# EAGLE design blink1mk3_usbc3535A (EAGLE 9.6.2)
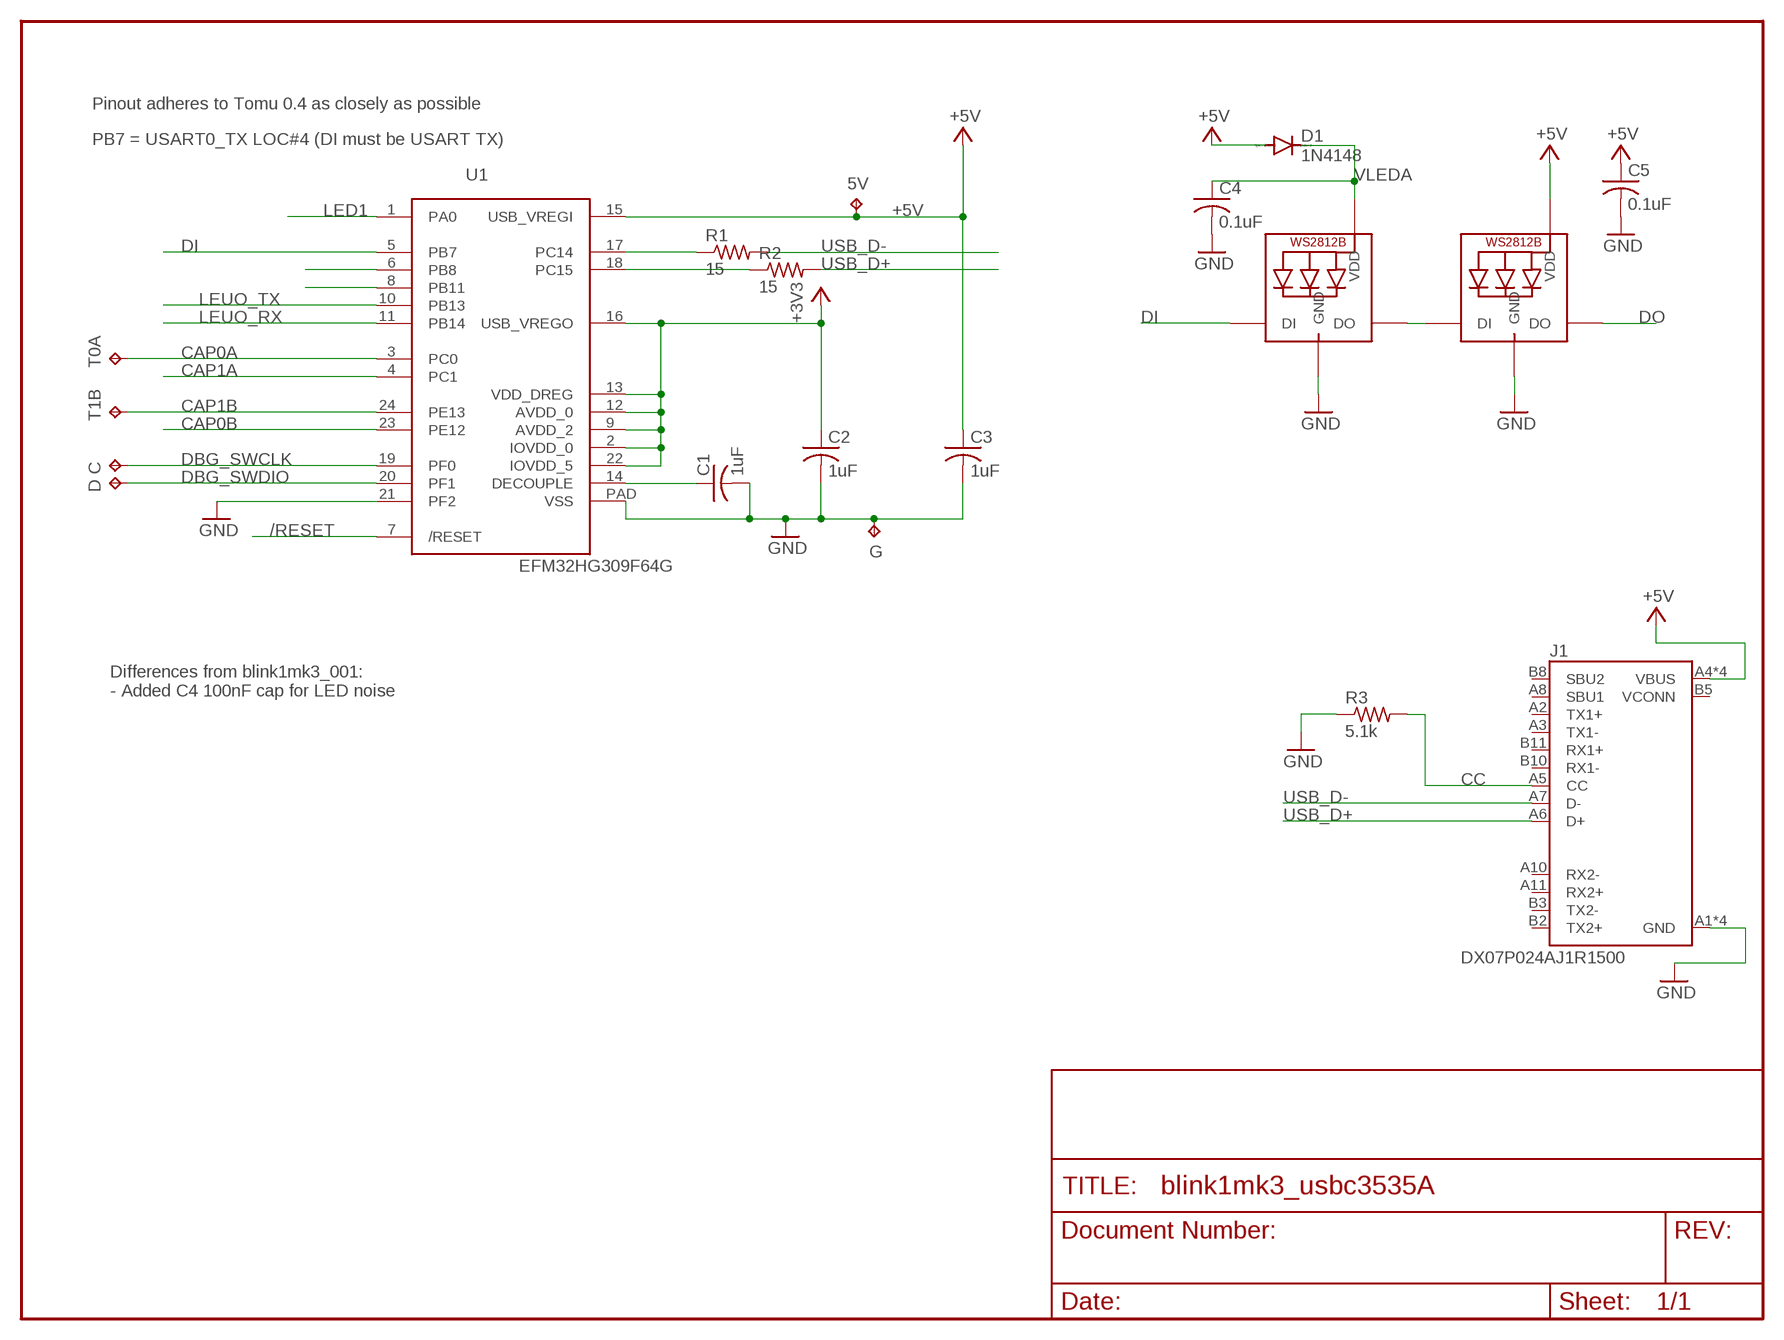
[diagram p0: schematic, sheet 1]

## Parts
5V  TPTP10R  [TP10R]
C  TPTP10R  [TP10R]
C1  1uF  C-USC0402  [C0402]
C2  1uF  C-USC0402  [C0402]
C3  1uF  C-USC0402  [C0402]
C4  0.1uF  C-USC0402  [C0402]
C5  0.1uF  C-USC0402  [C0402]
D  TPTP10R  [TP10R]
D1  1N4148  DIODE-SOD523  [SOD523]
G  TPTP10R  [TP10R]
J1  DX07P024AJ1R1500  [JAE_DX07P024AJ1R1500]
LED1  WS2812B3535  [LED3535]
LED2  SK6812MINI  WS2812B3535  [LED3535]
R1  15  R-US_R0402  [R0402]
R2  15  R-US_R0402  [R0402]
R3  5.1k  R-US_R0402  [R0402]
T0A  TPTP10R  [TP10R]
T1B  TPTP10R  [TP10R]
U1  EFM32HG309F64G  [QFN24PAD]

## Nets
+3V3: C2.1 U1.2(IOVDD_0) U1.9(AVDD_2) U1.12(AVDD_0) U1.13(VDD_DREG) U1.16(USB_VREGO) U1.22(IOVDD_5)
+5V: 5V.TP C3.1 C5.1 D1.A J1.A4(VBUS) J1.A9(VBUS) J1.B4(VBUS) J1.B9(VBUS) LED2.2(VDD) U1.15(USB_VREGI)
/RESET: U1.7(/RESET)
CAP0A: T0A.TP U1.3(PC0)
CAP0B: U1.23(PE12)
CAP1A: U1.4(PC1)
CAP1B: T1B.TP U1.24(PE13)
CC: J1.A5(CC) R3.2
DBG_SWCLK: C.TP U1.19(PF0)
DBG_SWDIO: D.TP U1.20(PF1)
DECOUPLE: C1.1 U1.14(DECOUPLE)
DI: LED1.1(DI) U1.5(PB7)
DO: LED2.3(DO)
GND: C1.2 C2.2 C3.2 C4.2 C5.2 G.TP J1.A1(GND) J1.A12(GND) J1.B1(GND) J1.B12(GND) LED1.4(GND) LED2.4(GND) R3.1 U1.21(PF2) U1.PAD(VSS)
LED1: U1.1(PA0)
LEUO_RX: U1.11(PB14)
LEUO_TX: U1.10(PB13)
N$1: U1.8(PB11)
N$2: LED1.3(DO) LED2.1(DI)
N$3: U1.6(PB8)
RUSB_D+: R2.1 U1.18(PC15)
RUSB_D-: R1.1 U1.17(PC14)
USB_D+: J1.A6(D+) R2.2
USB_D-: J1.A7(D-) R1.2
VLEDA: C4.1 D1.C LED1.2(VDD)
Unconnected: J1.A2(TX1+) J1.A3(TX1-) J1.A8(SBU1) J1.A10(RX2-) J1.A11(RX2+) J1.B2(TX2+) J1.B3(TX2-) J1.B8(SBU2) J1.B10(RX1-) J1.B11(RX1+)

## Notes on the sheet
- Pinout adheres to Tomu 0.4 as closely as possible
- PB7 = USART0_TX LOC#4 (DI must be USART TX)
- Differences from blink1mk3_001:
  - Added C4 100nF cap for LED noise

## Power pins joined to a net without a drawn wire
VCONN: J1.B5(VCONN)

## Library data of the parts
5V C D G T0A T1B = testpad:TP: Test pad
C1-C5 = rcl:C-US: CAPACITOR, American symbol; SPICEPREFIX: C
D1 = diode:DIODE-: DIODE
J1 = DX07P024AJ1R1500:DX07P024AJ1R1500: Cut Tape - Usb Type c Slim Plug; DESCRIPTION: Cut Tape - Usb Type c Slim Plug; DIGI-KEY_PART_NUMBER: 670-2868-1-ND; DIGI-KEY_PURCHASE_URL: https://www.digikey.com/product-detail/en/jae-electronics/DX07P024AJ1R1500/670-2868-1-ND/6003057?utm_source=snapeda&utm_medium=aggregator&utm_campaign=symbol; MF: JAE Electronics; MP: DX07P024AJ1R1500; PACKAGE: None
LED1 = todstuff:WS2812B
LED2 = adafruit:WS2812B
R1-R3 = rcl:R-US_: RESISTOR, American symbol; SPICEPREFIX: R
U1 = todstuff:EFM32HG309F64G

## Board
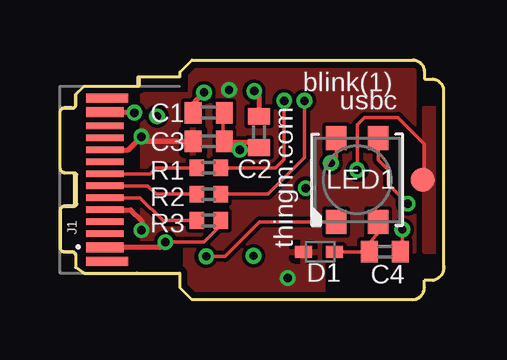
[diagram p1: board, top side]
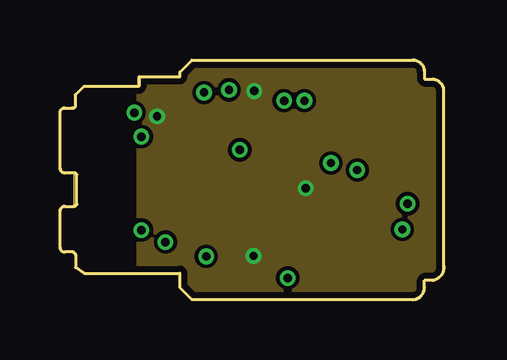
[diagram p2: board, inner layer Route2]
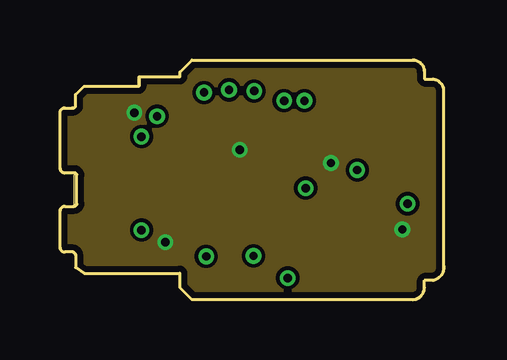
[diagram p3: board, inner layer Route15]
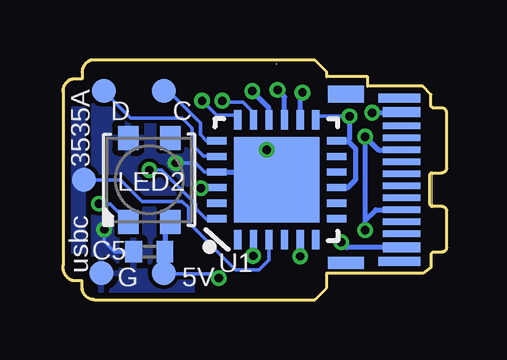
[diagram p4: board, bottom side, seen from below]

Size 16.01 x 10 mm. Coordinates in mm from the lower left corner, seen from the top.
Outline: 3.3,9.3 5,9.3 5,9.5 5.5,10 14.7,10 arc-90 15.2,9.5 15.2,9.2 15.56,9.2 arc-90 16,8.66 16,1.44 arc-90 15.56,0.8 15.2,0.8 15.2,0.5 arc-90 14.7,0 5.5,0 5,0.5 5,1.1 1,1.1 0.65,1.34 0.65,1.85 arc90 0.55,1.98 0.2,1.98 arc-90 0,2.18 0,3.69 arc-90 0.2,3.89 0.6,3.89 arc90 0.7,4 0.7,5.2 arc90 0.6,5.29 0.2,5.29 arc-90 0,5.49 0,7.8 arc-90 0.2,8 0.5,8 arc90 0.65,8.08 0.65,8.56 1,8.9 3.3,8.9 3.3,9.3
Copper layers (1+2*15+16): Top 0.035mm / dielectric 0.2mm / Route2 0.0175mm / dielectric 0.295mm / Route15 0.0175mm / dielectric 0.2mm / Bottom 0.035mm
Design rules "SeeedStudio_2layer_DRU_no_angle_20140221 *": minimum track width 6mil, minimum drill 12mil, track to track 6mil, track to pad 6mil, pad to pad 6mil, via to via 6mil, smd to smd 0mil, copper to edge 10mil, drill to drill 10mil, minimum pad ring 10mil, minimum via ring 6mil, stop-mask expansion 2mil, vias tented up to drill 100mil, thermal gap 10mil

### Footprints (pad centres in the part's own frame; a part is rotated, then mirrored left to right if it is on the bottom)
TP10R = smd 1 x 1: TP 0,0
C0402 = smd 0.7 x 0.9: 1 -0.65,0; 2 0.65,0
SOD523 = smd 0.7 x 0.5: A 0.7,0; C -0.6,0
JAE_DX07P024AJ1R1500 = smd 0.36 x 1.75: 13 -3.405,1.975; 14 3.405,1.975 | smd 0.36 x 1.75 bottom: 15 -3.405,1.975; 16 3.405,1.975 | smd 0.7 x 1.5 bottom: 17 -3.575,4.2 | smd 0.5 x 1.5 bottom: 18 3.475,4.2 | smd 0.41 x 1.55: A1 2.825,1.875; A12 -2.825,1.875 | smd 0.26 x 1.55: A2 2.25,1.875; A3 1.75,1.875; A4 1.25,1.875; A5 0.75,1.875; A6 0.25,1.875; A7 -0.25,1.875; A8 -0.75,1.875; A9 -1.25,1.875; A10 -1.75,1.875; A11 -2.25,1.875 | smd 0.41 x 1.55 bottom: B1 -2.825,1.875; B12 2.825,1.875 | smd 0.26 x 1.55 bottom: B2 -2.25,1.875; B3 -1.75,1.875; B4 -1.25,1.875; B5 -0.75,1.875; B6 -0.25,1.875; B7 0.25,1.875; B8 0.75,1.875; B9 1.25,1.875; B10 1.75,1.875; B11 2.25,1.875
LED3535 = smd 1 x 0.85: 1 -1.75,0.875; 2 -1.75,-0.875; 3 1.75,-0.875; 4 1.75,0.875
R0402 = smd 0.6 x 0.7: 1 -0.5,0; 2 0.5,0
QFN24PAD = smd 0.8 x 0.3: 1 -2.5,1.625; 2 -2.5,0.975; 3 -2.5,0.325; 4 -2.5,-0.325; 5 -2.5,-0.975; 6 -2.5,-1.625; 13 2.5,-1.625; 14 2.5,-0.975; 15 2.5,-0.325; 16 2.5,0.325; 17 2.5,0.975; 18 2.5,1.625 | smd 0.3 x 0.8: 7 -1.625,-2.5; 8 -0.975,-2.5; 9 -0.325,-2.5; 10 0.325,-2.5; 11 0.975,-2.5; 12 1.625,-2.5; 19 1.625,2.5; 20 0.975,2.5; 21 0.325,2.5; 22 -0.325,2.5; 23 -0.975,2.5; 24 -1.625,2.5 | smd 3.55 x 3.55: PAD 0,0

### Placement (x,y rotation side)
5V  11.8,1.1 0 bottom
C  11.8,8.7 0 bottom
C1  6.2,7.8 0 top
C2  8.3,7 270 top
C3  6.2,6.6 0 top
C4  13.55,2 0 top
C5  12.4,2 180 bottom
D  14.3,8.7 0 bottom
D1  10.85,2 180 top
G  14.4,1.1 180 bottom
J1  0,5 270 top
LED1  12.4,5 90 top
LED2  12.4,5 90 bottom
R1  6.2,5.5 180 top
R2  6.2,4.4 180 top
R3  6.2,3.3 180 top
T0A  15.13,5 0 bottom
T1B  15.13,5 0 top
U1  7.08,5 90 bottom

### Tracks (layer width: path | path; a pad name or v marks a point on that pad's centre or on a via)
+3V3  (via drill 0.35)
  Top 0.203: v8.1,8.7 8.3,8.5 C2.1
  Bottom 0.152: U1.13 5.31,7.65 v4.05,7.65
  Bottom 0.2: U1.16 7.41,7.86
  Bottom 0.203: v8.07,1.82 8.06,1.83 U1.2 | U1.22 10.22,4.67 v10.25,4.65 | U1.12 4.12,6.62 | 4.12,6.62 3.8,6.3 3.8,5 4.12,4.67 U1.9 | v8.1,8.7 8.1,8.68 7.41,7.99 U1.16 | v4.05,7.65 4.05,6.7 4.12,6.62
  pour Route2: 3.3,12.11 18.9,12.11 18.9,-2.49 3.3,-2.49
+5V  (via drill 0.35)
  Top 0.2: J1.A4 2.95,3.75 3.4,3.3 v3.4,2.9 | v3.4,6.8 3.6,6.6 C3.1
  Top 0.203: J1.A9 2.85,6.25 v3.4,6.8
  Bottom 0.152: 5V.TP 11.78,1.08 9.68,1.08 v9.5,0.9 | 2,3.75 J1.A4
  Bottom 0.2: 2,3.75 2.95,3.75 3.4,3.3 v3.4,2.9 v3.4,6.8 2.85,6.25 | v7.05,8.75 6.76,8.46 U1.15 | 5V.TP 11.8,1.95 C5.1 11.75,3.02 LED2.2
  Bottom 0.203: 2.85,6.25 J1.A9
  pour Top: 3.4,2.3 3.4,8.6 5.4,8.6 5.4,10.2 14.8,10.2 14.8,2 11,2 11.01,-0.2 5.2,-0.2 5.2,2.3
CAP0A
  Bottom 0.152: U1.3 7.41,1.67 7.82,1.25 8.8,1.25 10.77,3.22 10.77,3.84 11.03,4.1 12.7,4.1 13.6,5 T0A.TP
  pour Bottom (no thermals): 15.11,8 16,8 16,2 15.11,2
CAP1B  (via drill 0.35)
  Top 0.152: T1B.TP 15.2,5.07 15.2,6.5 14.1,7.6 12.7,7.6 12.4,7.3 v12.4,5.41
  Bottom 0.152: v12.4,5.41 v12.4,5.4 11.89,5.4 10.47,3.98 10.47,3.8 10.04,3.38 U1.24
  pour Top (no thermals): 15.21,8 16,8 16,2 15.21,2
CC
  Top 0.152: J1.A5 3.35,4.25 4.3,3.3 R3.2
DBG_SWCLK
  Bottom 0.152: U1.19 10,6.62 10.26,6.88 10.26,7.37 11.59,8.7 C.TP
DBG_SWDIO
  Bottom 0.152: U1.20 9.61,6 10.15,6 10.61,6.47 10.61,7.16 11.02,7.58 13.18,7.58 D.TP
DECOUPLE  (via drill 0.35)
  Top 0.203: v6.01,8.64 5.61,8.24 5.61,7.86 C1.1
  Bottom 0.203: v6.01,8.64 6.11,8.54 U1.14
DI  (via drill 0.35)
  Top 0.152: LED1.1 8.33,3.25 6.88,1.8 v6.1,1.8
  Bottom 0.152: v6.1,1.8 U1.5
GND  (via drill 0.35)
  Top 0.152: R3.1 6.7,3.1 6,2.4 v4.4,2.4 | LED1.4 11.52,5.92 v11.3,5.7 | C3.2 6.8,6.6 6.8,7.75 C1.2 | C4.2 14.28,2.08 v14.28,2.93
  Top 0.203: J1.A12 3.07,7.83 v3.1,7.8 | v4.4,2.4 4.17,2.17 J1.B12 | 6.8,6.6 C3.2 7.05,6.6 7.1,6.55 7.5,6.55 | C2.2 8.1,6.55 7.5,6.55 | 7.5,6.55 v7.5,6.25
  Bottom 0.152: U1.21 10.1,5.33 10.48,5.7 v11.3,5.7 | 13.05,1.93 C5.2 13.85,2 14.28,2.43 v14.28,2.93 | LED2.4
  Bottom 0.203: U1.21 7.41,5.33 U1.PAD | J1.A12 1.9,7.8 v3.1,7.8 v3.1,7.79 | J1.B12 4.17,2.17 v4.4,2.4
  pour Bottom: 10.62,10.16 10.62,-0.23 14.73,-0.23 14.73,10.16
  pour Route15: -0.31,12.11 18.77,12.11 18.77,-2.62 -0.31,-2.62
N$2  (via drill 0.35)
  Top 0.152: v14.5,4 13.7,4.8 13.7,5.4 13.27,5.83 LED1.3
  Bottom 0.152: v14.5,4 14.02,4 LED2.1
RUSB_D+  (via drill 0.35)
  Top 0.152: v10.2,8.3 10.2,5.92 8.68,4.4 R2.1
  Bottom 0.152: U1.18 8.71,7.7 9.6,7.7 v10.2,8.3
RUSB_D-  (via drill 0.35)
  Top 0.152: R1.1 8.99,5.5 9.35,5.85 v9.35,8.3
  Bottom 0.152: U1.17 8.06,7.81 8.5,8.25 9.3,8.25 v9.35,8.3
USB_D+
  Top 0.152: R2.2 4,4.4 3.65,4.75 J1.A6
USB_D-
  Top 0.152: R1.2 4.9,5.5 4,5.5 3.75,5.25 J1.A7
VLEDA
  Top 0.152: LED1.2 13.27,2.8 12.94,2.4 12.94,2.05 C4.1 D1.C

### Text on the board
tPlace: blink(1) | usbc | thingm.com
bPlace: 3535A | usbc